# Altium project VNA.PrjPcb (part 2 of 2)

## Sheet VNA_8.SchDoc: VNA
size 409 x 289 mm; Origin: Eagle; OriginPath: C:\Users\Ground Lab\Desktop\LibreVNA\Hardware\Eagle\VNA.sch; OriginSheet: 9; Date: 04.05.2025 20:03:37; SheetNumber: 9; GateName_1: G$1; SymbolName_1: A3L-LOC; LibraryName: VNA; DeviceSetName: A3L-LOC; Sheet: Sheet:
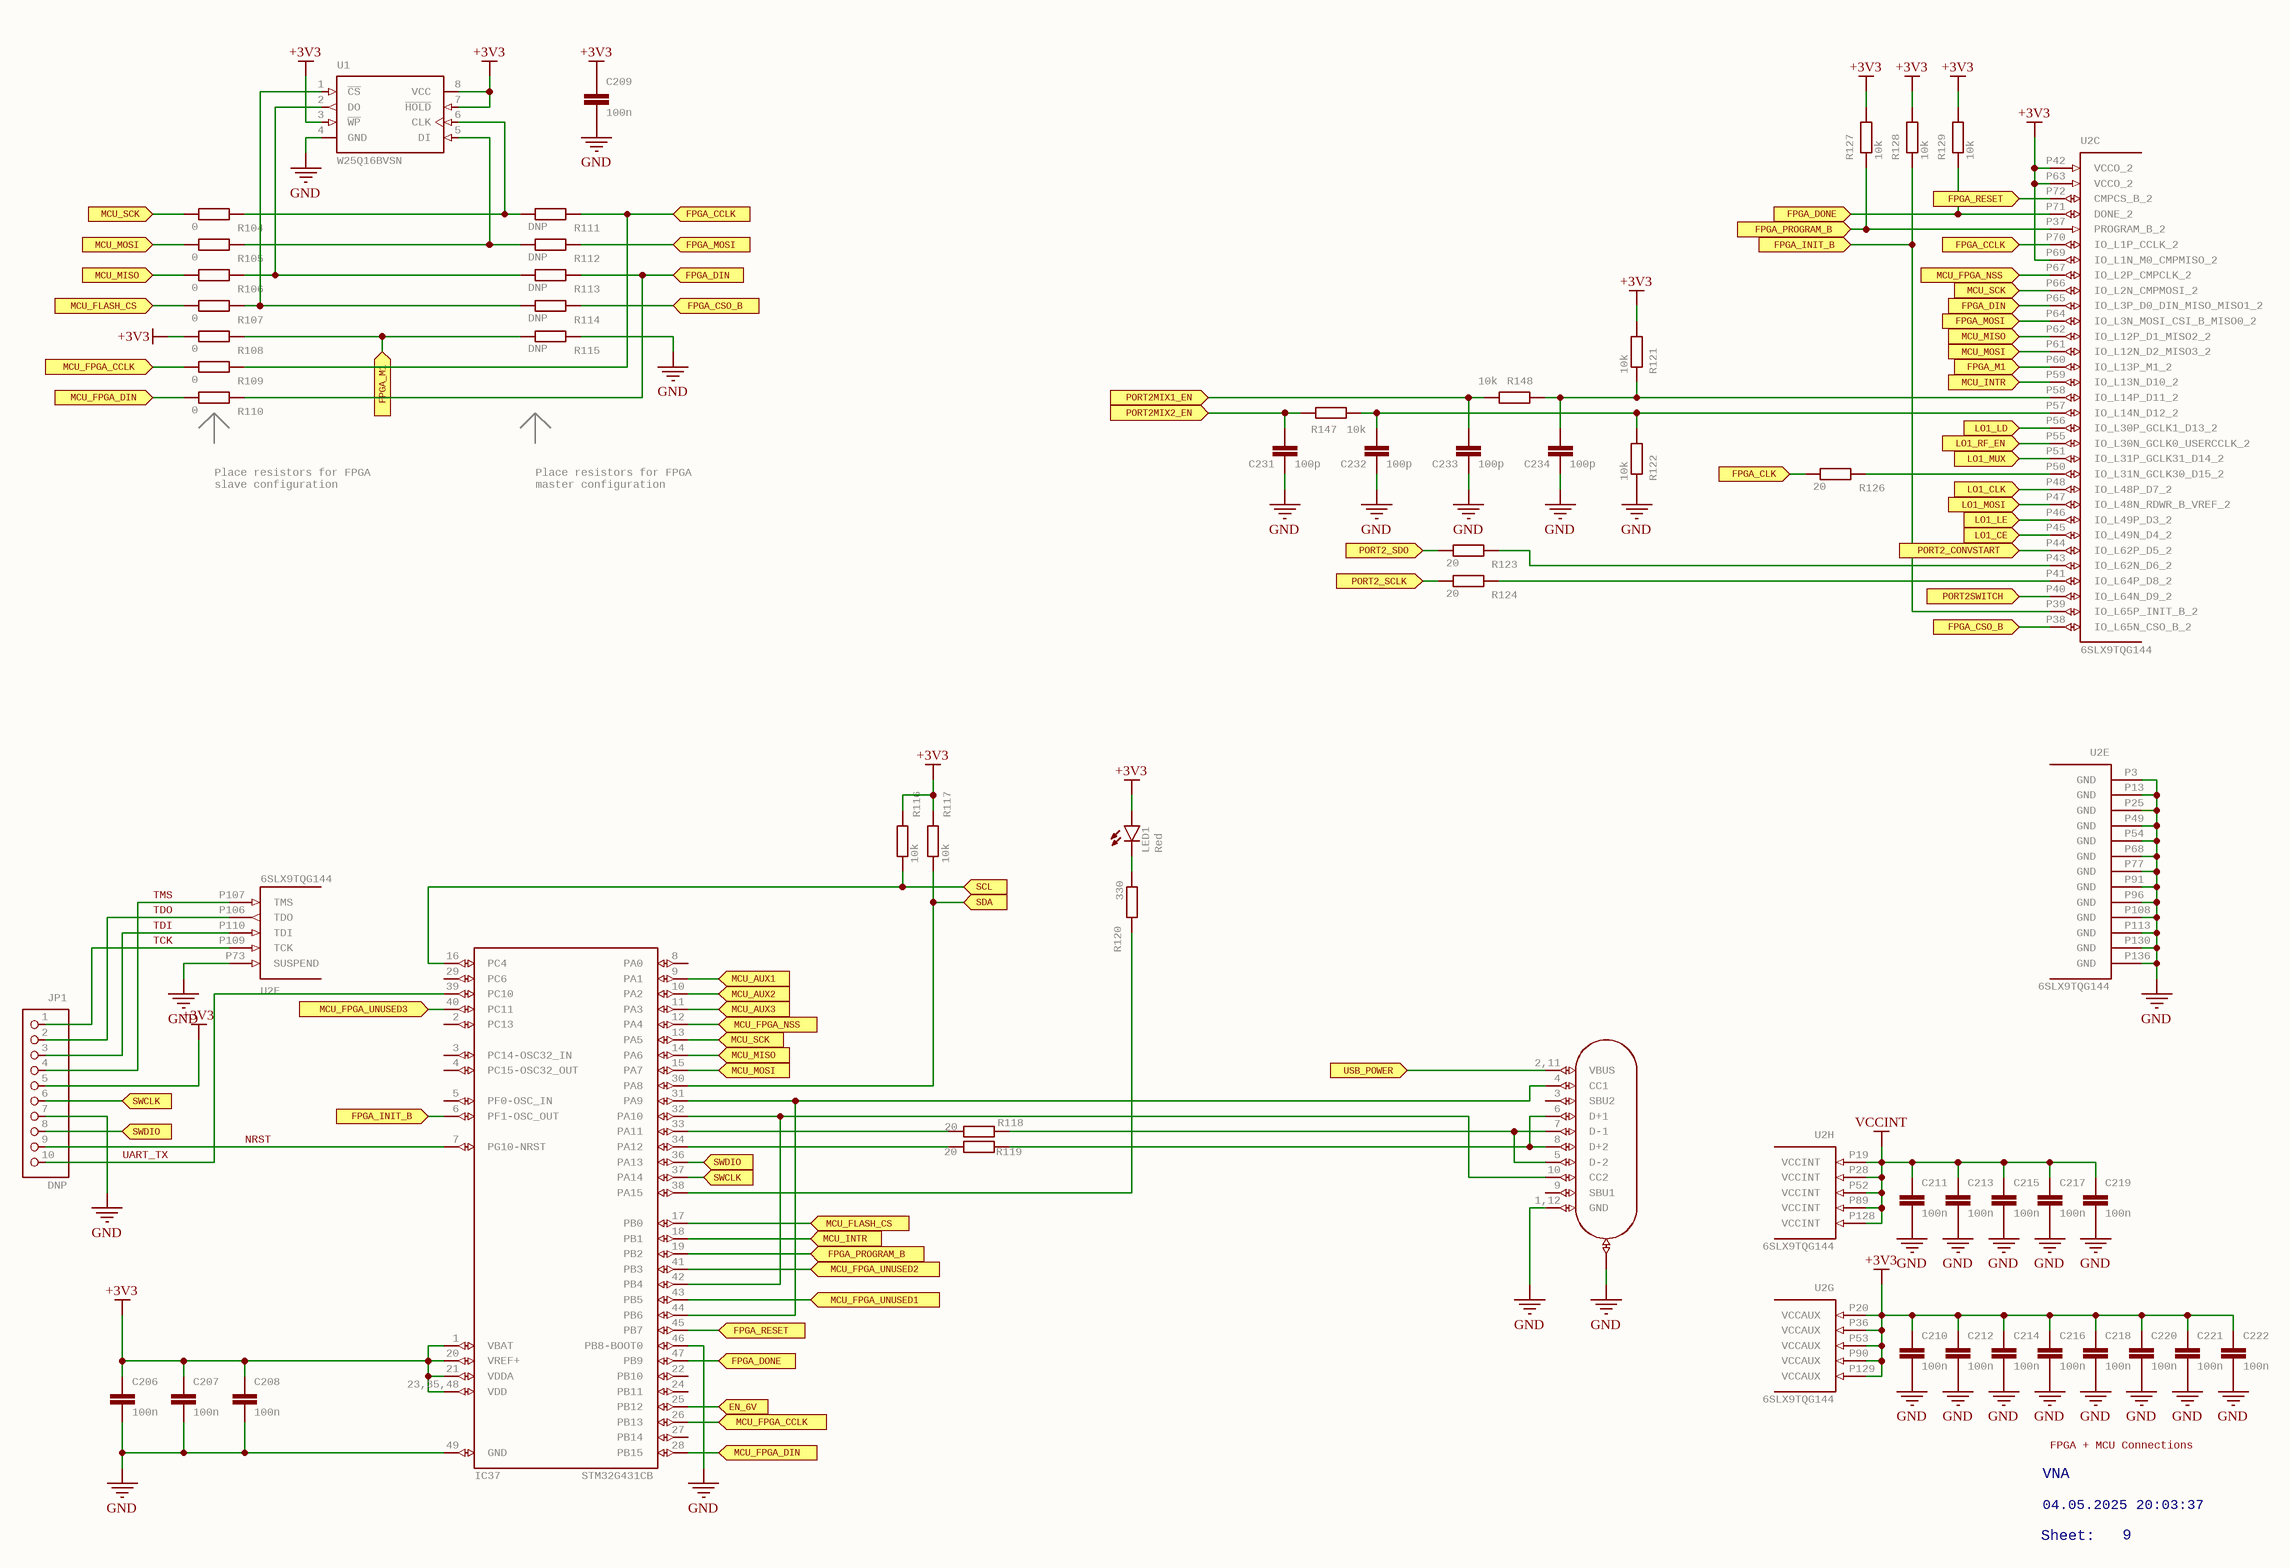
[diagram p8: VNA_8.SchDoc]

### Parts
C206  100n  [C0402]
C207  100n  [C0402]
C208  100n  [C0402]
C209  100n  [C0402]
C210  100n  [C0402]
C211  100n  [C0402]
C212  100n  [C0402]
C213  100n  [C0402]
C214  100n  [C0402]
C215  100n  [C0402]
C216  100n  [C0402]
C217  100n  [C0402]
C218  100n  [C0402]
C219  100n  [C0402]
C220  100n  [C0402]
C221  100n  [C0402]
C222  100n  [C0402]
C231  100p  [C0402]
C232  100p  [C0402]
C233  100p  [C0402]
C234  100p  [C0402]
IC37  STM32G431CB  [QFN50P700X700X60-49T560N]
J4  TYPE-C16P(073)  [TYPE-C16P]  (value not drawn)
JP1  DNP  [1X10/90]
LED1  Red  [CHIPLED_0603]
R104  0  [R0402]
R105  0  [R0402]
R106  0  [R0402]
R107  0  [R0402]
R108  0  [R0402]
R109  0  [R0402]
R110  0  [R0402]
R111  DNP  [R0402]
R112  DNP  [R0402]
R113  DNP  [R0402]
R114  DNP  [R0402]
R115  DNP  [R0402]
R116  10k  [R0402]
R117  10k  [R0402]
R118  20  [R0402]
R119  20  [R0402]
R120  330  [R0402]
R121  10k  [R0402]
R122  10k  [R0402]
R123  20  [R0402]
R124  20  [R0402]
R126  20  [R0402]
R127  10k  [R0402]
R128  10k  [R0402]
R129  10k  [R0402]
R147  10k  [R0402]
R148  10k  [R0402]
U1  W25Q16BVSN  [SO08]
U2  6SLX9TQG144  [TQ144]  (parts C,E,F,G,H of 8)

### Ports
EN_6V (in), FPGA_CCLK (in), FPGA_CLK (in), FPGA_CSO_B (in), FPGA_DIN (in), FPGA_DONE (in), FPGA_INIT_B (in), FPGA_M1 (in), FPGA_MOSI (in), FPGA_PROGRAM_B (in), FPGA_RESET (in), LO1_CE (in), LO1_CLK (in), LO1_LD (in), LO1_LE (in), LO1_MOSI (in), LO1_MUX (in), LO1_RF_EN (in), MCU_AUX1 (in), MCU_AUX2 (in), MCU_AUX3 (in), MCU_FLASH_CS (in), MCU_FPGA_CCLK (in), MCU_FPGA_DIN (in), MCU_FPGA_NSS (in), MCU_FPGA_UNUSED1 (in), MCU_FPGA_UNUSED2 (in), MCU_FPGA_UNUSED3 (in), MCU_INTR (in), MCU_MISO (in), MCU_MOSI (in), MCU_SCK (in), PORT2_CONVSTART (in), PORT2_SCLK (in), PORT2_SDO (in), PORT2MIX1_EN (in), PORT2MIX2_EN (in), PORT2SWITCH (in), SCL (in), SDA (in), SWCLK (in), SWDIO (in), USB_POWER (in)

### Nets
+3V3: C206.1 C207.1 C208.1 C209.1 C210.1 C212.1 C214.1 C216.1 C218.1 C220.1 C221.1 C222.1 IC37.1(VBAT) IC37.20(VREF+) IC37.21(VDDA) IC37.23,35,48(VDD) JP1.5 LED1.A R108.1 R116.2 R117.2 R121.2 R127.2 R128.2 R129.2 U1.3(~{WP}) U1.7(~{HOLD}) U1.8(VCC) U2.P20(VCCAUX) U2.P36(VCCAUX) U2.P42(VCCO_2) U2.P53(VCCAUX) U2.P63(VCCO_2) U2.P69(IO_L1N_M0_CMPMISO_2) U2.P90(VCCAUX) U2.P129(VCCAUX)
GND: C206.2 C207.2 C208.2 C209.2 C210.2 C211.2 C212.2 C213.2 C214.2 C215.2 C216.2 C217.2 C218.2 C219.2 C220.2 C221.2 C222.2 C231.2 C232.2 C233.2 C234.2 IC37.46(PB8-BOOT0) IC37.49(GND) J4.1,12(GND) J4.M1-4(CASE) JP1.7 R115.2 R122.1 U1.4(GND) U2.P3(GND) U2.P13(GND) U2.P25(GND) U2.P49(GND) U2.P54(GND) U2.P68(GND) U2.P73(SUSPEND) U2.P77(GND) U2.P91(GND) U2.P96(GND) U2.P108(GND) U2.P113(GND) U2.P130(GND) U2.P136(GND)
VCCINT: C211.1 C213.1 C215.1 C217.1 C219.1 U2.P19(VCCINT) U2.P28(VCCINT) U2.P52(VCCINT) U2.P89(VCCINT) U2.P128(VCCINT)
NRST: IC37.7(PG10-NRST) JP1.9
TCK: JP1.1 U2.P109(TCK)
TDI: JP1.3 U2.P110(TDI)
TDO: JP1.2 U2.P106(TDO)
TMS: JP1.4 U2.P107(TMS)
UART_TX: IC37.39(PC10) JP1.10
NetC80_2: U2.P45(IO_L49N_D4_2) ; port LO1_CE
NetC231_1: C231.1 R147.2 ; port PORT2MIX2_EN
NetC232_1: C232.1 R122.2 R147.1 U2.P57(IO_L14N_D12_2)
NetC233_1: C233.1 R148.1 ; port PORT2MIX1_EN
NetC234_1: C234.1 R121.1 R148.2 U2.P58(IO_L14P_D11_2)
NetC235_1: U2.P40(IO_L64N_D9_2) ; port PORT2SWITCH
NetIC1_11: IC37.25(PB12) ; port EN_6V
NetIC2_10: IC37.30(PA8) R117.1 ; port SDA
NetIC2_11: IC37.16(PC4) R116.1 ; port SCL
NetIC7_15: R126.1 ; port FPGA_CLK
NetIC21_1: U2.P48(IO_L48P_D7_2) ; port LO1_CLK
NetIC21_2: U2.P47(IO_L48N_RDWR_B_VREF_2) ; port LO1_MOSI
NetIC21_3: U2.P46(IO_L49P_D3_2) ; port LO1_LE
NetIC21_25: U2.P56(IO_L30P_GCLK1_D13_2) ; port LO1_LD
NetIC21_26: U2.P55(IO_L30N_GCLK0_USERCCLK_2) ; port LO1_RF_EN
NetIC21_30: U2.P51(IO_L31P_GCLK31_D14_2) ; port LO1_MUX
NetIC31_6: U2.P44(IO_L62P_D5_2) ; port PORT2_CONVSTART
NetIC31_7: R123.1 ; port PORT2_SDO
NetIC31_8: R124.1 ; port PORT2_SCLK
NetIC37_6: IC37.6(PF1-OSC_OUT) R128.1 U2.P39(IO_L65P_INIT_B_2) ; port FPGA_INIT_B
NetIC37_9: IC37.9(PA1) ; port MCU_AUX1
NetIC37_10: IC37.10(PA2) ; port MCU_AUX2
NetIC37_11: IC37.11(PA3) ; port MCU_AUX3
NetIC37_12: IC37.12(PA4) U2.P67(IO_L2P_CMPCLK_2) ; port MCU_FPGA_NSS
NetIC37_13: IC37.13(PA5) R104.1 U2.P66(IO_L2N_CMPMOSI_2) ; port MCU_SCK
NetIC37_14: IC37.14(PA6) R106.1 U2.P62(IO_L12P_D1_MISO2_2) ; port MCU_MISO
NetIC37_15: IC37.15(PA7) R105.1 U2.P61(IO_L12N_D2_MISO3_2) ; port MCU_MOSI
NetIC37_17: IC37.17(PB0) R107.1 ; port MCU_FLASH_CS
NetIC37_18: IC37.18(PB1) U2.P59(IO_L13N_D10_2) ; port MCU_INTR
NetIC37_19: IC37.19(PB2) R127.1 U2.P37(PROGRAM_B_2) ; port FPGA_PROGRAM_B
NetIC37_26: IC37.26(PB13) R109.1 ; port MCU_FPGA_CCLK
NetIC37_28: IC37.28(PB15) R110.1 ; port MCU_FPGA_DIN
NetIC37_31: IC37.31(PA9) IC37.44(PB6) J4.4(CC1)
NetIC37_32: IC37.32(PA10) IC37.42(PB4) J4.10(CC2)
NetIC37_33: IC37.33(PA11) R118.2
NetIC37_34: IC37.34(PA12) R119.1
NetIC37_36: IC37.36(PA13) JP1.8 ; port SWDIO
NetIC37_37: IC37.37(PA14) JP1.6 ; port SWCLK
NetIC37_38: IC37.38(PA15) R120.2
NetIC37_40: IC37.40(PC11) ; port MCU_FPGA_UNUSED3
NetIC37_41: IC37.41(PB3) ; port MCU_FPGA_UNUSED2
NetIC37_43: IC37.43(PB5) ; port MCU_FPGA_UNUSED1
NetIC37_45: IC37.45(PB7) U2.P72(CMPCS_B_2) ; port FPGA_RESET
NetIC37_47: IC37.47(PB9) R129.1 U2.P71(DONE_2) ; port FPGA_DONE
NetJ4_2,11: J4.2,11(VBUS) ; port USB_POWER
NetJ4_5: J4.5(D-2) J4.6(D+1) J4.7(D-1) J4.8(D+2) R118.1 R119.2
NetLED1_C: LED1.C R120.1
NetR104_2: R104.2 R111.1 U1.6(CLK)
NetR105_2: R105.2 R112.1 U1.5(DI)
NetR106_2: R106.2 R113.1 U1.2(DO)
NetR107_2: R107.2 R114.1 U1.1(~{CS})
NetR108_2: R108.2 R115.1 U2.P60(IO_L13P_M1_2) ; port FPGA_M1
NetR109_2: R109.2 R111.2 U2.P70(IO_L1P_CCLK_2) ; port FPGA_CCLK
NetR110_2: R110.2 R113.2 U2.P65(IO_L3P_D0_DIN_MISO_MISO1_2) ; port FPGA_DIN
NetR112_2: R112.2 U2.P64(IO_L3N_MOSI_CSI_B_MISO0_2) ; port FPGA_MOSI
NetR114_2: R114.2 U2.P38(IO_L65N_CSO_B_2) ; port FPGA_CSO_B
NetR123_2: R123.2 U2.P43(IO_L62N_D6_2)
NetR124_2: R124.2 U2.P41(IO_L64P_D8_2)
NetR126_2: R126.2 U2.P50(IO_L31N_GCLK30_D15_2)

Not connected (* = marked no-connect by the designer): IC37 2(PC13) 3(PC14-OSC32_IN) 4(PC15-OSC32_OUT) 5(PF0-OSC_IN) 8(PA0) 22(PB10) 24(PB11) 27(PB14) 29(PC6); J4 3(SBU2) 9(SBU1)

### Notes on the sheet
- Place resistors for FPGA
  slave configuration
- Place resistors for FPGA
  master configuration
- VNA
- FPGA + MCU Connections
- Sheet:
- 04.05.2025 20:03:37
- 9

### Library data of the parts
C206-C222 C231-C234 = C-EU*?:2C0402: as C4 on sheet VNA_0; DeviceName: C0402; LibraryName: VNA; DeviceSetName: C-EU*?:2
IC37 = STM32G431CB: GateName_1: G$1; SymbolName_1: STM32G431CB; LibraryName: VNA; DeviceSetName: STM32G431CB
J4 = TYPE-C16P(073): GateName_1: G$1; SymbolName_1: USB-C; LibraryName: VNA; DeviceSetName: TYPE-C16P(073)
JP1 = PINHD-1X10/90: PIN HEADER; GateName_1: A; SymbolName_1: PINHD10; DeviceName: /90; LibraryName: VNA; DeviceSetName: PINHD-1X10
LED1 = LEDCHIPLED_0603: LED   OSRAM: - CHIPLED LG R971, LG N971, LY N971, LG Q971, LY Q971, LO R971, LY R971 LH N974, LH R974 LS Q976, LO Q976, LY Q976 LO Q996 - Hyper CHIPLED LW Q18S LB Q993, LB Q99A, LB R99A - SideLED LS A670, LO A670, LY A670, LG A670, LP A670 LB A673, LV A673, LT A673, LW A673 LH A674 LY A675 LS A676, LA A676, LO A676, LY A676, LW A676 LS A679, LY A679, LG A679 -  Hyper Micro SIDELEDÂ® LS Y876, LA Y876, LO Y876, LY Y876 LT Y87S - SmartLED LW L88C, LW L88S LB L89C, LB L89S, LG L890 LS L89K, LO L89K, LY L89K LS L896, LA L896, LO L896, LY L896 - TOPLED LS T670, LO T670, LY T670, LG T670, LP T670 LSG T670, LSP T670, LSY T670, LOP T670, LYG T670 LG T671, LOG T671, LSG T671 LB T673, LV T673, LT T673, LW T673 LH T674 LS T676, LA T676, LO T676, LY T676, LB T676, LH T676, LSB T676, LW T676 LB T67C, LV T67C, LT T67C, LS T67K, LO T67K, LY T67K, LW E67C LS E67B, LA E67B, LO E67B, LY E67B, LB E67C, LV E67C, LT E67C LW T67C LS T679, LY T679, LG T679 LS T770, LO T770, LY T770, LG T770, LP T770 LB T773, LV T773, LT T773, LW T773 LH T774 LS E675, LA E675, LY E675, LS T675 LS T776, LA T776, LO T776, LY T776, LB T776 LHGB T686 LT T68C, LB T68C - Hyper Mini TOPLEDÂ® LB M676 - Mini TOPLED SantanaÂ® LG M470 LS M47K, LO M47K, LY M47K    Source: http://www.osram.convergy.de   LUXEON: - LUMILEDÂ® LXK2-PW12-R00, LXK2-PW12-S00, LXK2-PW14-U00, LXK2-PW14-V00 LXK2-PM12-R00, LXK2-PM12-S00, LXK2-PM14-U00 LXK2-PE12-Q00, LXK2-PE12-R00, LXK2-PE12-S00, LXK2-PE14-T00, LXK2-PE14-U00 LXK2-PB12-K00, LXK2-PB12-L00, LXK2-PB12-M00, LXK2-PB14-N00, LXK2-PB14-P00, LXK2-PB14-Q00 LXK2-PR12-L00, LXK2-PR12-M00, LXK2-PR14-Q00, LXK2-PR14-R00 LXK2-PD12-Q00, LXK2-PD12-R00, LXK2-PD12-S00 LXK2-PH12-R00, LXK2-PH12-S00 LXK2-PL12-P00, LXK2-PL12-Q00, LXK2-PL12-R00    Source: www.luxeon.com   KINGBRIGHT:   KA-3528ASYC Source: www.kingbright.com; GateName_1: G$1; POPULARITY: 0; SymbolName_1: LED; DeviceName: CHIPLED_0603; LibraryName: VNA; DeviceSetName: LED
R104-R124 R126-R129 R147 R148 = R-EU_R0402: as R1 on sheet VNA_0; DeviceName: R0402; LibraryName: VNA
U1 = W25Q16BVSN: EEPROM   4 Mbit SPI Serial Flash7; GateName_1: G$1; SymbolName_1: 25XX; DeviceName: SN; LibraryName: VNA; DeviceSetName: W25Q16BV
U2 = 6SLX9TQG144: Xilinx FPGA: 6SLX9TQG144; GateName_1: B0; SymbolName_1: 6SLX9TQG144_0; GateName_2: B1; SymbolName_2: 6SLX9TQG144_1; GateName_3: B2; SymbolName_3: 6SLX9TQG144_2; GateName_4: B3; SymbolName_4: 6SLX9TQG144_3; GateName_5: BGND; SymbolName_5: 6SLX9TQG144_GND; GateName_6: BNA; SymbolName_6: 6SLX9TQG144_NA; GateName_7: BVCCAUX; SymbolName_7: 6SLX9TQG144_VCCAUX; GateName_8: BVCCINT; SymbolName_8: 6SLX9TQG144_VCCINT; LibraryName: VNA; DeviceSetName: 6SLX9TQG144

## Sheet VNA_9.SchDoc: VNA
size 409 x 289 mm; Origin: Eagle; OriginPath: C:\Users\Ground Lab\Desktop\LibreVNA\Hardware\Eagle\VNA.sch; OriginSheet: 10; Date: 04.05.2025 20:03:37; SheetNumber: 10; GateName_1: G$1; SymbolName_1: A3L-LOC; LibraryName: VNA; DeviceSetName: A3L-LOC; Sheet: Sheet:
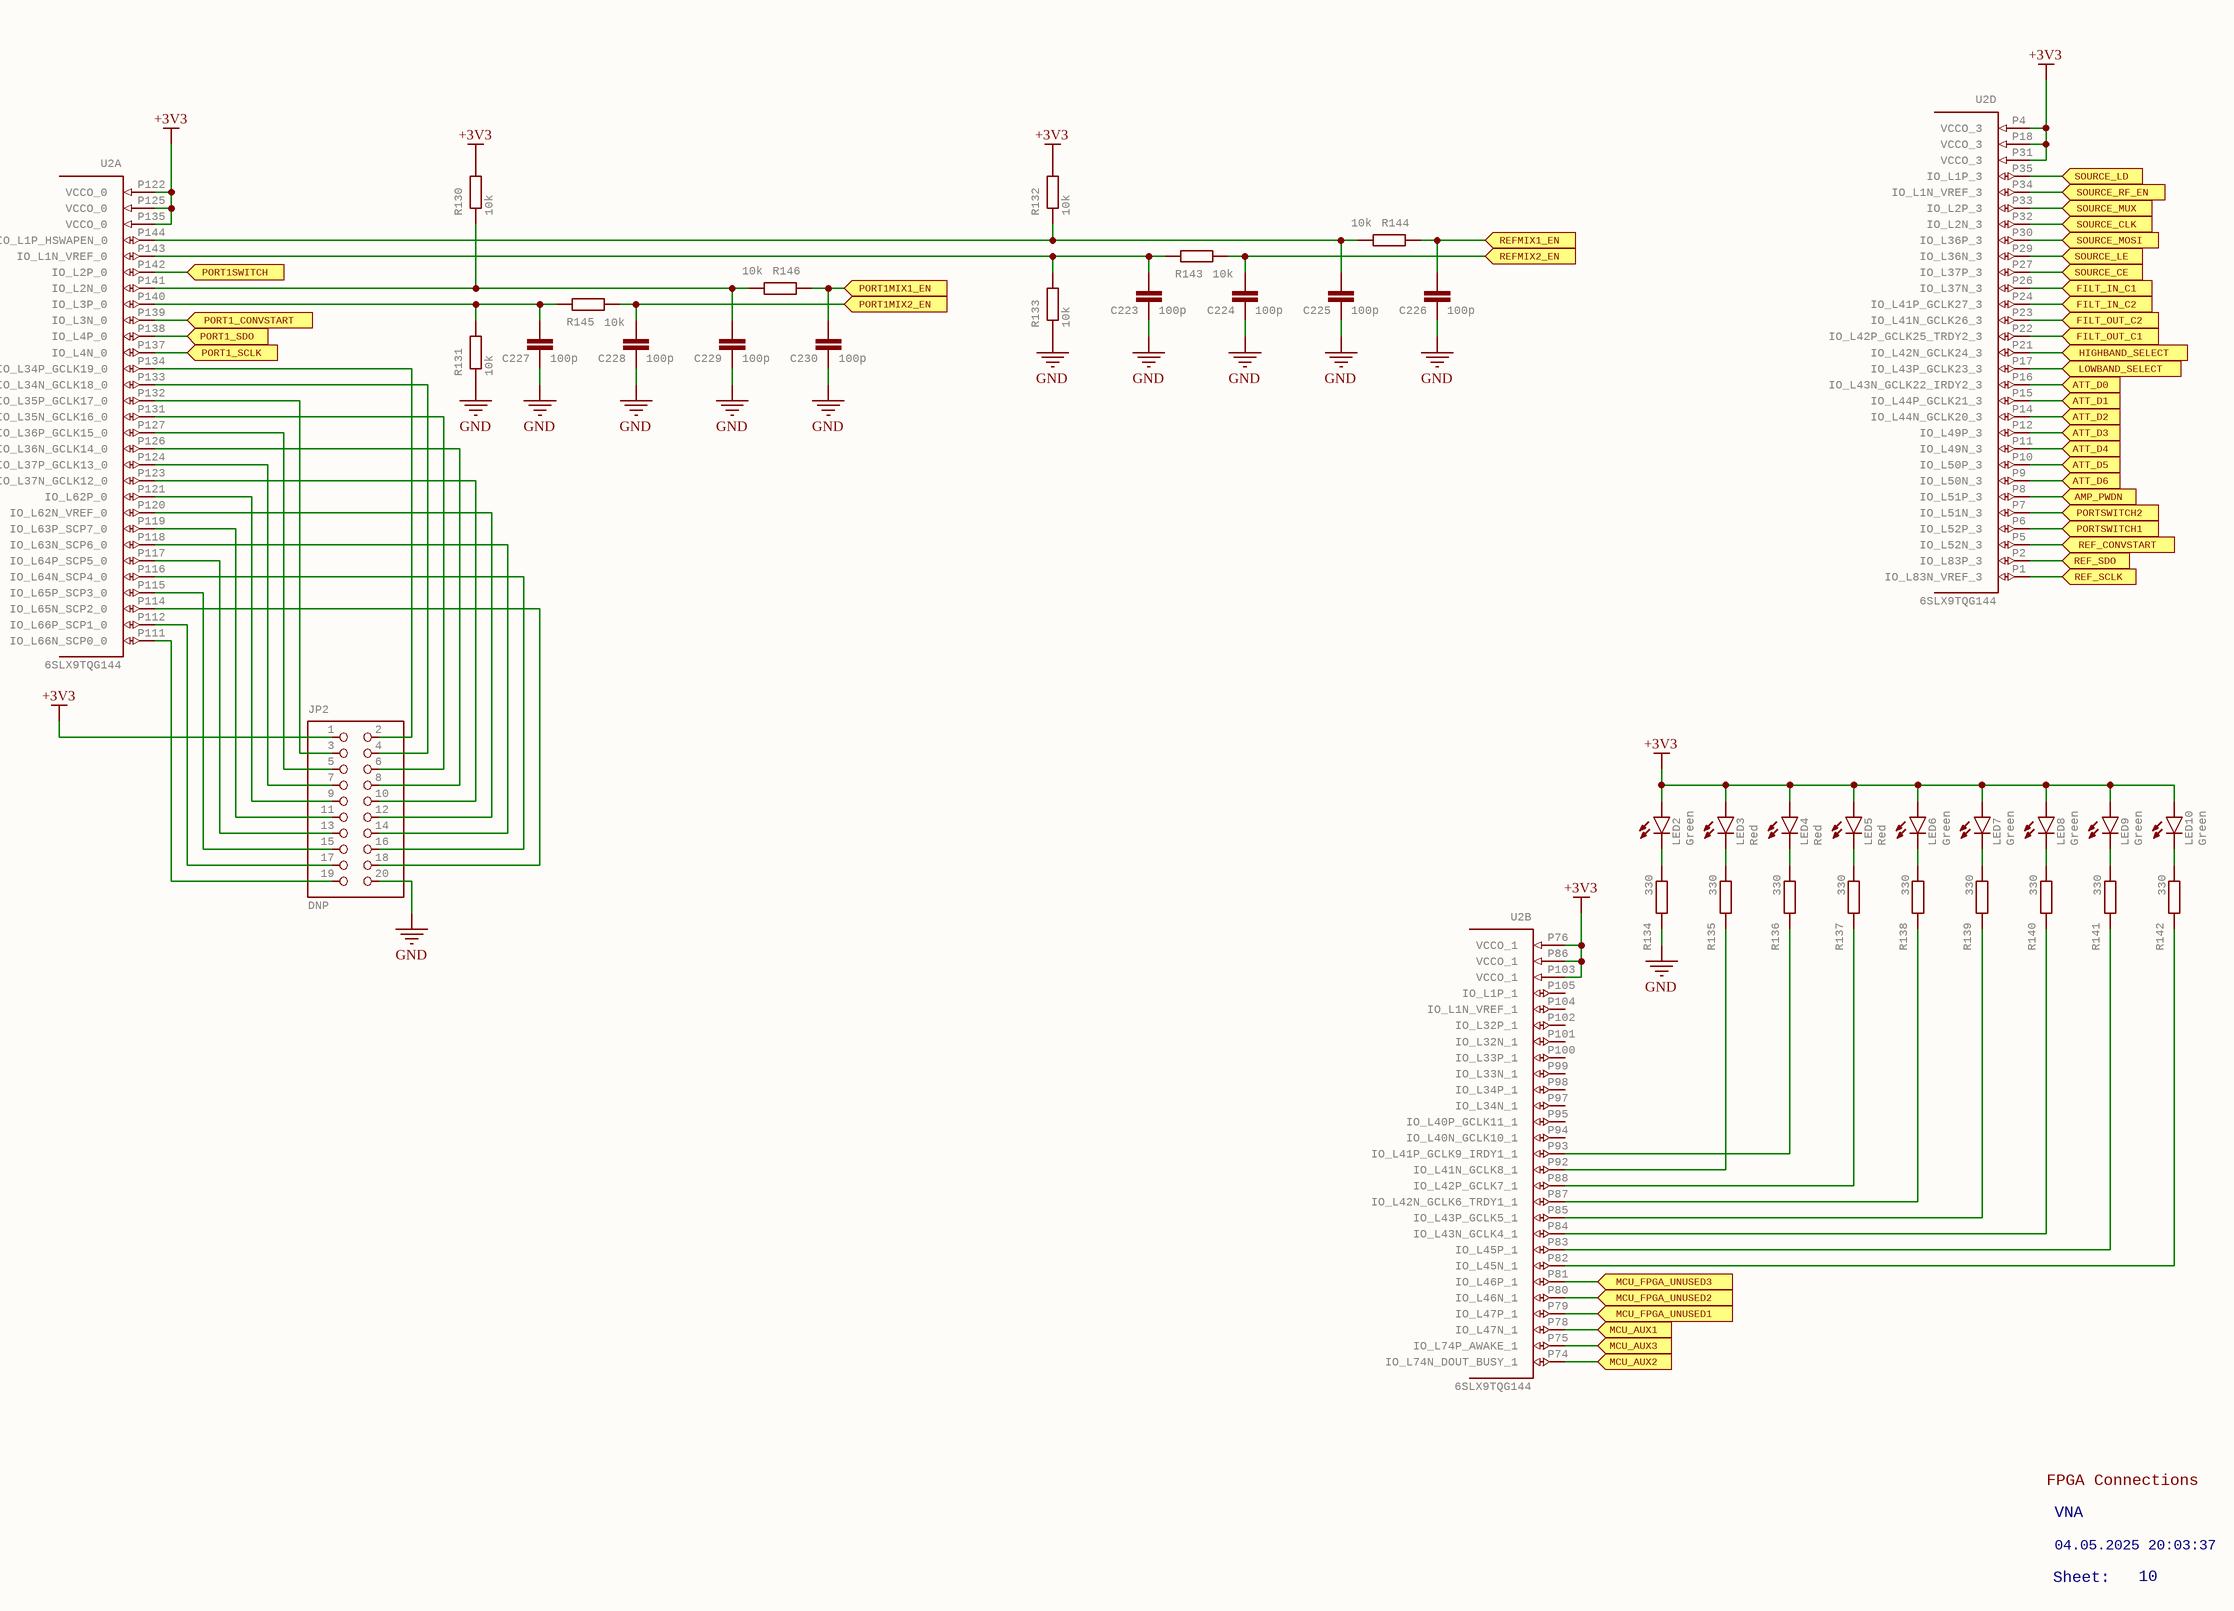
[diagram p9: VNA_9.SchDoc]

### Parts
C223  100p  [C0402]
C224  100p  [C0402]
C225  100p  [C0402]
C226  100p  [C0402]
C227  100p  [C0402]
C228  100p  [C0402]
C229  100p  [C0402]
C230  100p  [C0402]
JP2  DNP  [2X10]
LED2  Green  [CHIPLED_0603]
LED3  Red  [CHIPLED_0603]
LED4  Red  [CHIPLED_0603]
LED5  Red  [CHIPLED_0603]
LED6  Green  [CHIPLED_0603]
LED7  Green  [CHIPLED_0603]
LED8  Green  [CHIPLED_0603]
LED9  Green  [CHIPLED_0603]
LED10  Green  [CHIPLED_0603]
R130  10k  [R0402]
R131  10k  [R0402]
R132  10k  [R0402]
R133  10k  [R0402]
R134  330  [R0402]
R135  330  [R0402]
R136  330  [R0402]
R137  330  [R0402]
R138  330  [R0402]
R139  330  [R0402]
R140  330  [R0402]
R141  330  [R0402]
R142  330  [R0402]
R143  10k  [R0402]
R144  10k  [R0402]
R145  10k  [R0402]
R146  10k  [R0402]
U2  6SLX9TQG144  [TQ144]  (parts A,B,D of 8)

### Ports
AMP_PWDN (in), ATT_D0 (in), ATT_D1 (in), ATT_D2 (in), ATT_D3 (in), ATT_D4 (in), ATT_D5 (in), ATT_D6 (in), FILT_IN_C1 (in), FILT_IN_C2 (in), FILT_OUT_C1 (in), FILT_OUT_C2 (in), HIGHBAND_SELECT (in), LOWBAND_SELECT (in), MCU_AUX1 (in), MCU_AUX2 (in), MCU_AUX3 (in), MCU_FPGA_UNUSED1 (in), MCU_FPGA_UNUSED2 (in), MCU_FPGA_UNUSED3 (in), PORT1_CONVSTART (in), PORT1_SCLK (in), PORT1_SDO (in), PORT1MIX1_EN (in), PORT1MIX2_EN (in), PORT1SWITCH (in), PORTSWITCH1 (in), PORTSWITCH2 (in), REF_CONVSTART (in), REF_SCLK (in), REF_SDO (in), REFMIX1_EN (in), REFMIX2_EN (in), SOURCE_CE (in), SOURCE_CLK (in), SOURCE_LD (in), SOURCE_LE (in), SOURCE_MOSI (in), SOURCE_MUX (in), SOURCE_RF_EN (in)

### Nets
+3V3: JP2.1 JP2.7 LED2.A LED3.A LED4.A LED5.A LED6.A LED7.A LED8.A LED9.A LED10.A R130.2 R132.2 U2.P4(VCCO_3) U2.P18(VCCO_3) U2.P31(VCCO_3) U2.P76(VCCO_1) U2.P86(VCCO_1) U2.P103(VCCO_1) U2.P122(VCCO_0) U2.P124(IO_L37P_GCLK13_0) U2.P125(VCCO_0) U2.P135(VCCO_0)
GND: C223.2 C224.2 C225.2 C226.2 C227.2 C228.2 C229.2 C230.2 JP2.20 R131.1 R133.1 R134.2
NetC223_1: C223.1 R133.2 R143.2 U2.P143(IO_L1N_VREF_0)
NetC224_1: C224.1 R143.1 ; port REFMIX2_EN
NetC225_1: C225.1 R132.1 R144.1 U2.P144(IO_L1P_HSWAPEN_0)
NetC226_1: C226.1 R144.2 ; port REFMIX1_EN
NetC227_1: C227.1 R131.2 R145.2 U2.P140(IO_L3P_0)
NetC228_1: C228.1 R145.1 ; port PORT1MIX2_EN
NetC229_1: C229.1 R130.1 R146.1 U2.P141(IO_L2N_0)
NetC230_1: C230.1 R146.2 ; port PORT1MIX1_EN
NetC237_1: U2.P7(IO_L51N_3) ; port PORTSWITCH2
NetC239_1: U2.P6(IO_L52P_3) ; port PORTSWITCH1
NetC241_1: U2.P142(IO_L2P_0) ; port PORT1SWITCH
NetC243_1: U2.P8(IO_L51P_3) ; port AMP_PWDN
NetC245_1: U2.P21(IO_L42N_GCLK24_3) ; port HIGHBAND_SELECT
NetC247_1: U2.P17(IO_L43P_GCLK23_3) ; port LOWBAND_SELECT
NetC249_1: U2.P16(IO_L43N_GCLK22_IRDY2_3) ; port ATT_D0
NetC251_1: U2.P15(IO_L44P_GCLK21_3) ; port ATT_D1
NetC253_1: U2.P14(IO_L44N_GCLK20_3) ; port ATT_D2
NetC255_1: U2.P12(IO_L49P_3) ; port ATT_D3
NetC258_1: U2.P9(IO_L50N_3) ; port ATT_D6
NetC260_1: U2.P10(IO_L50P_3) ; port ATT_D5
NetC262_1: U2.P11(IO_L49N_3) ; port ATT_D4
NetC263_1: U2.P26(IO_L37N_3) ; port FILT_IN_C1
NetC264_1: U2.P24(IO_L41P_GCLK27_3) ; port FILT_IN_C2
NetC265_1: U2.P23(IO_L41N_GCLK26_3) ; port FILT_OUT_C2
NetC266_1: U2.P22(IO_L42P_GCLK25_TRDY2_3) ; port FILT_OUT_C1
NetC267_1: U2.P27(IO_L37P_3) ; port SOURCE_CE
NetC271_1: U2.P34(IO_L1N_VREF_3) ; port SOURCE_RF_EN
NetC273_1: U2.P35(IO_L1P_3) ; port SOURCE_LD
NetIC26_6: U2.P139(IO_L3N_0) ; port PORT1_CONVSTART
NetIC26_7: U2.P138(IO_L4P_0) ; port PORT1_SDO
NetIC26_8: U2.P137(IO_L4N_0) ; port PORT1_SCLK
NetIC35_6: U2.P5(IO_L52N_3) ; port REF_CONVSTART
NetIC35_7: U2.P2(IO_L83P_3) ; port REF_SDO
NetIC35_8: U2.P1(IO_L83N_VREF_3) ; port REF_SCLK
NetIC37_9: U2.P78(IO_L47N_1) ; port MCU_AUX1
NetIC37_10: U2.P74(IO_L74N_DOUT_BUSY_1) ; port MCU_AUX2
NetIC37_11: U2.P75(IO_L74P_AWAKE_1) ; port MCU_AUX3
NetIC37_40: U2.P81(IO_L46P_1) ; port MCU_FPGA_UNUSED3
NetIC37_41: U2.P80(IO_L46N_1) ; port MCU_FPGA_UNUSED2
NetIC37_43: U2.P79(IO_L47P_1) ; port MCU_FPGA_UNUSED1
NetJP2_2: JP2.2 U2.P134(IO_L34P_GCLK19_0)
NetJP2_3: JP2.3 U2.P132(IO_L35P_GCLK17_0)
NetJP2_4: JP2.4 U2.P133(IO_L34N_GCLK18_0)
NetJP2_5: JP2.5 U2.P127(IO_L36P_GCLK15_0)
NetJP2_6: JP2.6 U2.P131(IO_L35N_GCLK16_0)
NetJP2_8: JP2.8 U2.P126(IO_L36N_GCLK14_0)
NetJP2_9: JP2.9 U2.P121(IO_L62P_0)
NetJP2_10: JP2.10 U2.P123(IO_L37N_GCLK12_0)
NetJP2_11: JP2.11 U2.P119(IO_L63P_SCP7_0)
NetJP2_12: JP2.12 U2.P120(IO_L62N_VREF_0)
NetJP2_13: JP2.13 U2.P117(IO_L64P_SCP5_0)
NetJP2_14: JP2.14 U2.P118(IO_L63N_SCP6_0)
NetJP2_15: JP2.15 U2.P115(IO_L65P_SCP3_0)
NetJP2_16: JP2.16 U2.P116(IO_L64N_SCP4_0)
NetJP2_17: JP2.17 U2.P112(IO_L66P_SCP1_0)
NetJP2_18: JP2.18 U2.P114(IO_L65N_SCP2_0)
NetJP2_19: JP2.19 U2.P111(IO_L66N_SCP0_0)
NetLED2_C: LED2.C R134.1
NetLED3_C: LED3.C R135.1
NetLED4_C: LED4.C R136.1
NetLED5_C: LED5.C R137.1
NetLED6_C: LED6.C R138.1
NetLED7_C: LED7.C R139.1
NetLED8_C: LED8.C R140.1
NetLED9_C: LED9.C R141.1
NetLED10_C: LED10.C R142.1
NetR135_2: R135.2 U2.P92(IO_L41N_GCLK8_1)
NetR136_2: R136.2 U2.P93(IO_L41P_GCLK9_IRDY1_1)
NetR137_2: R137.2 U2.P88(IO_L42P_GCLK7_1)
NetR138_2: R138.2 U2.P87(IO_L42N_GCLK6_TRDY1_1)
NetR139_2: R139.2 U2.P85(IO_L43P_GCLK5_1)
NetR140_2: R140.2 U2.P84(IO_L43N_GCLK4_1)
NetR141_2: R141.2 U2.P83(IO_L45P_1)
NetR142_2: R142.2 U2.P82(IO_L45N_1)
NetR164_2: U2.P32(IO_L2N_3) ; port SOURCE_CLK
NetR167_2: U2.P33(IO_L2P_3) ; port SOURCE_MUX
NetR170_2: U2.P30(IO_L36P_3) ; port SOURCE_MOSI
NetR171_2: U2.P29(IO_L36N_3) ; port SOURCE_LE

Not connected (* = marked no-connect by the designer): U2 P94(IO_L40N_GCLK10_1) P95(IO_L40P_GCLK11_1) P97(IO_L34N_1) P98(IO_L34P_1) P99(IO_L33N_1) P100(IO_L33P_1) P101(IO_L32N_1) P102(IO_L32P_1) P104(IO_L1N_VREF_1) P105(IO_L1P_1)

### Notes on the sheet
- FPGA Connections
- VNA
- Sheet:
- 04.05.2025 20:03:37
- 10

### Library data of the parts
C223-C230 = C-EU*?:2C0402: CAPACITOR, European symbol; GateName_1: G$1; SymbolName_1: C-EU:1; DeviceName: C0402; LibraryName: VNA; DeviceSetName: C-EU*?:2
JP2 = PINHD-2X10: PIN HEADER; GateName_1: A; SymbolName_1: PINH2X10; LibraryName: VNA; DeviceSetName: PINHD-2X10
LED2-LED10 = LEDCHIPLED_0603: LED   OSRAM: - CHIPLED LG R971, LG N971, LY N971, LG Q971, LY Q971, LO R971, LY R971 LH N974, LH R974 LS Q976, LO Q976, LY Q976 LO Q996 - Hyper CHIPLED LW Q18S LB Q993, LB Q99A, LB R99A - SideLED LS A670, LO A670, LY A670, LG A670, LP A670 LB A673, LV A673, LT A673, LW A673 LH A674 LY A675 LS A676, LA A676, LO A676, LY A676, LW A676 LS A679, LY A679, LG A679 -  Hyper Micro SIDELEDÂ® LS Y876, LA Y876, LO Y876, LY Y876 LT Y87S - SmartLED LW L88C, LW L88S LB L89C, LB L89S, LG L890 LS L89K, LO L89K, LY L89K LS L896, LA L896, LO L896, LY L896 - TOPLED LS T670, LO T670, LY T670, LG T670, LP T670 LSG T670, LSP T670, LSY T670, LOP T670, LYG T670 LG T671, LOG T671, LSG T671 LB T673, LV T673, LT T673, LW T673 LH T674 LS T676, LA T676, LO T676, LY T676, LB T676, LH T676, LSB T676, LW T676 LB T67C, LV T67C, LT T67C, LS T67K, LO T67K, LY T67K, LW E67C LS E67B, LA E67B, LO E67B, LY E67B, LB E67C, LV E67C, LT E67C LW T67C LS T679, LY T679, LG T679 LS T770, LO T770, LY T770, LG T770, LP T770 LB T773, LV T773, LT T773, LW T773 LH T774 LS E675, LA E675, LY E675, LS T675 LS T776, LA T776, LO T776, LY T776, LB T776 LHGB T686 LT T68C, LB T68C - Hyper Mini TOPLEDÂ® LB M676 - Mini TOPLED SantanaÂ® LG M470 LS M47K, LO M47K, LY M47K    Source: http://www.osram.convergy.de   LUXEON: - LUMILEDÂ® LXK2-PW12-R00, LXK2-PW12-S00, LXK2-PW14-U00, LXK2-PW14-V00 LXK2-PM12-R00, LXK2-PM12-S00, LXK2-PM14-U00 LXK2-PE12-Q00, LXK2-PE12-R00, LXK2-PE12-S00, LXK2-PE14-T00, LXK2-PE14-U00 LXK2-PB12-K00, LXK2-PB12-L00, LXK2-PB12-M00, LXK2-PB14-N00, LXK2-PB14-P00, LXK2-PB14-Q00 LXK2-PR12-L00, LXK2-PR12-M00, LXK2-PR14-Q00, LXK2-PR14-R00 LXK2-PD12-Q00, LXK2-PD12-R00, LXK2-PD12-S00 LXK2-PH12-R00, LXK2-PH12-S00 LXK2-PL12-P00, LXK2-PL12-Q00, LXK2-PL12-R00    Source: www.luxeon.com   KINGBRIGHT:   KA-3528ASYC Source: www.kingbright.com; GateName_1: G$1; POPULARITY: 0; SymbolName_1: LED; DeviceName: CHIPLED_0603; LibraryName: VNA; DeviceSetName: LED
R130-R146 = R-EU_R0402: RESISTOR, European symbol; GateName_1: G$1; SymbolName_1: R-EU; DeviceSetName: R-EU_; DeviceName: R0402; LibraryName: VNA
U2 = 6SLX9TQG144: Xilinx FPGA: 6SLX9TQG144; GateName_1: B0; SymbolName_1: 6SLX9TQG144_0; GateName_2: B1; SymbolName_2: 6SLX9TQG144_1; GateName_3: B2; SymbolName_3: 6SLX9TQG144_2; GateName_4: B3; SymbolName_4: 6SLX9TQG144_3; GateName_5: BGND; SymbolName_5: 6SLX9TQG144_GND; GateName_6: BNA; SymbolName_6: 6SLX9TQG144_NA; GateName_7: BVCCAUX; SymbolName_7: 6SLX9TQG144_VCCAUX; GateName_8: BVCCINT; SymbolName_8: 6SLX9TQG144_VCCINT; LibraryName: VNA; DeviceSetName: 6SLX9TQG144

## Nets that join several sheets
+3V3: VNA_0 (C14.1 C15.1 L4.P$2 TP2.TP), VNA_1 (5 pins), VNA_2 (L64.2), VNA_3 (6 pins), VNA_4 (L65.2), VNA_5 (C132.2 IC26.9 IC26.10), VNA_6 (C169.2 IC31.9 IC31.10), VNA_7 (C201.2 IC35.9 IC35.10), VNA_8 (36 pins), VNA_9 (23 pins)
+5V/1: VNA_0 (C26.2 L6.2 TP5.TP), VNA_5 (6 pins)
+5V/2: VNA_0 (C27.2 L7.2 TP7.TP), VNA_6 (6 pins)
+5V/3: VNA_0 (C28.2 L8.2 TP9.TP), VNA_7 (6 pins)
+5V/4: VNA_0 (L9.2 TP11.TP), VNA_2 (5 pins), VNA_4 (5 pins)
GND: VNA_0 (44 pins), VNA_1 (24 pins), VNA_2 (48 pins), VNA_3 (48 pins), VNA_4 (29 pins), VNA_5 (32 pins), VNA_6 (30 pins), VNA_7 (29 pins), VNA_8 (43 pins), VNA_9 (12 pins)
VCCINT: VNA_0 (5 pins), VNA_8 (10 pins)
NetC36_1: VNA_1 (7 pins), VNA_4 (C80.1)
NetC44_1: VNA_1 (C44.1 R181.2), VNA_6 (C135.1)
NetC45_1: VNA_1 (C45.1 R178.2), VNA_7 (C200.1)
NetC46_1: VNA_1 (C46.1 R177.2), VNA_5 (C98.1)
NetC48_1: VNA_1 (C48.1), VNA_3 (IC13.13)
NetC51_1: VNA_1 (IC7.8), VNA_2 (C51.1)
NetC68_2: VNA_2 (C68.2), VNA_3 (IC13.3)
NetC80_2: VNA_4 (C80.2 IC21.4 IC21.29 R31.2), VNA_8 (U2.P45)
NetC96_1: VNA_3 (IC18.3), VNA_5 (C96.1)
NetC133_1: VNA_3 (IC17.8), VNA_6 (C133.1)
NetC151_1: VNA_4 (IC21.14 R34.1), VNA_6 (C151.1)
NetC170_1: VNA_3 (R27.1 R28.2), VNA_7 (C170.1)
NetC224_1: VNA_7 (IC32.7 IC36.2), VNA_9 (C224.1 R143.1)
NetC226_1: VNA_7 (IC33.9), VNA_9 (C226.1 R144.2)
NetC228_1: VNA_5 (IC22.2 IC23.7), VNA_9 (C228.1 R145.1)
NetC230_1: VNA_5 (IC24.9), VNA_9 (C230.1 R146.2)
NetC231_1: VNA_6 (IC27.2 IC28.7), VNA_8 (C231.1 R147.2)
NetC233_1: VNA_6 (IC29.9), VNA_8 (C233.1 R148.1)
NetC235_1: VNA_3 (C235.1 R149.2), VNA_8 (U2.P40)
NetC237_1: VNA_3 (C237.1 R150.2), VNA_9 (U2.P7)
NetC239_1: VNA_3 (C239.1 R151.2), VNA_9 (U2.P6)
NetC241_1: VNA_3 (C241.1 R152.2), VNA_9 (U2.P142)
NetC243_1: VNA_3 (C243.1 R153.2), VNA_9 (U2.P8)
NetC245_1: VNA_3 (C245.1 R154.2), VNA_9 (U2.P21)
NetC247_1: VNA_3 (C247.1 R155.2), VNA_9 (U2.P17)
NetC249_1: VNA_3 (C249.1 R156.2), VNA_9 (U2.P16)
NetC251_1: VNA_3 (C251.1 R157.2), VNA_9 (U2.P15)
NetC253_1: VNA_3 (C253.1 R158.2), VNA_9 (U2.P14)
NetC255_1: VNA_3 (C255.1 R159.2), VNA_9 (U2.P12)
NetC258_1: VNA_3 (C258.1 R160.1), VNA_9 (U2.P9)
NetC260_1: VNA_3 (C260.1 R161.1), VNA_9 (U2.P10)
NetC262_1: VNA_3 (C262.1 R162.1), VNA_9 (U2.P11)
NetC263_1: VNA_2 (C263.1 R21.2), VNA_9 (U2.P26)
NetC264_1: VNA_2 (C264.1 R20.2), VNA_9 (U2.P24)
NetC265_1: VNA_2 (C265.1 R22.2), VNA_9 (U2.P23)
NetC266_1: VNA_2 (C266.1 R24.2), VNA_9 (U2.P22)
NetC267_1: VNA_2 (C267.1 R11.2 R163.2), VNA_9 (U2.P27)
NetC269_1: VNA_4 (IC21.12 R32.1), VNA_5 (C269.1)
NetC270_1: VNA_4 (IC21.13 R33.1), VNA_7 (C270.1)
NetC271_1: VNA_2 (C271.1 R165.2), VNA_9 (U2.P34)
NetC273_1: VNA_2 (C273.1 R166.2), VNA_9 (U2.P35)
NetIC1_11: VNA_0 (IC1.11), VNA_8 (IC37.25)
NetIC2_10: VNA_0 (IC2.10), VNA_1 (IC7.5), VNA_8 (IC37.30 R117.1)
NetIC2_11: VNA_0 (IC2.11), VNA_1 (IC7.4), VNA_8 (IC37.16 R116.1)
NetIC7_15: VNA_1 (IC7.15), VNA_8 (R126.1)
NetIC21_1: VNA_4 (IC21.1), VNA_8 (U2.P48)
NetIC21_2: VNA_4 (IC21.2), VNA_8 (U2.P47)
NetIC21_3: VNA_4 (IC21.3), VNA_8 (U2.P46)
NetIC21_25: VNA_4 (IC21.25), VNA_8 (U2.P56)
NetIC21_26: VNA_4 (IC21.26), VNA_8 (U2.P55)
NetIC21_30: VNA_4 (IC21.30), VNA_8 (U2.P51)
NetIC26_6: VNA_5 (IC26.6), VNA_9 (U2.P139)
NetIC26_7: VNA_5 (IC26.7), VNA_9 (U2.P138)
NetIC26_8: VNA_5 (IC26.8), VNA_9 (U2.P137)
NetIC31_6: VNA_6 (IC31.6), VNA_8 (U2.P44)
NetIC31_7: VNA_6 (IC31.7), VNA_8 (R123.1)
NetIC31_8: VNA_6 (IC31.8), VNA_8 (R124.1)
NetIC35_6: VNA_7 (IC35.6), VNA_9 (U2.P5)
NetIC35_7: VNA_7 (IC35.7), VNA_9 (U2.P2)
NetIC35_8: VNA_7 (IC35.8), VNA_9 (U2.P1)
NetIC37_9: VNA_8 (IC37.9), VNA_9 (U2.P78)
NetIC37_10: VNA_8 (IC37.10), VNA_9 (U2.P74)
NetIC37_11: VNA_8 (IC37.11), VNA_9 (U2.P75)
NetIC37_40: VNA_8 (IC37.40), VNA_9 (U2.P81)
NetIC37_41: VNA_8 (IC37.41), VNA_9 (U2.P80)
NetIC37_43: VNA_8 (IC37.43), VNA_9 (U2.P79)
NetJ4_2,11: VNA_0 (Q1.3), VNA_8 (J4.2,11)
NetR164_2: VNA_2 (R164.2), VNA_9 (U2.P32)
NetR167_2: VNA_2 (R167.2), VNA_9 (U2.P33)
NetR170_2: VNA_2 (R170.2), VNA_9 (U2.P30)
NetR171_2: VNA_2 (R171.2), VNA_9 (U2.P29)